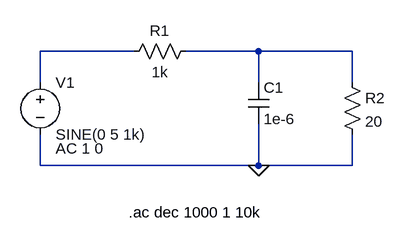
[diagram p0: schematic lowpass.asc]
lowpass.asc, the LTspice schematic file:
Version 4
SHEET 1 880 680
WIRE 384 224 240 224
WIRE 576 224 464 224
WIRE 720 224 576 224
WIRE 240 272 240 224
WIRE 576 272 576 224
WIRE 720 272 720 224
WIRE 240 400 240 352
WIRE 576 400 576 336
WIRE 576 400 240 400
WIRE 720 400 720 352
WIRE 720 400 576 400
FLAG 576 400 0
SYMBOL Res 480 208 R90
WINDOW 0 0 56 VBottom 2
WINDOW 3 32 56 VTop 2
SYMATTR InstName R1
SYMATTR Value 1k
SYMBOL Cap 560 272 R0
SYMATTR InstName C1
SYMATTR Value 1e-6
SYMBOL Res 704 256 R0
SYMATTR InstName R2
SYMATTR Value 20
SYMBOL voltage 240 256 R0
WINDOW 123 24 118 Left 2
SYMATTR InstName V1
SYMATTR Value SINE(0 5 1k)
SYMATTR Value2 AC 1 0
TEXT 376 472 Left 2 !.ac dec 1000 1 10k

The netlist it stands for:
* lowpass.asc
R1 N002 N001 1k
C1 N002 0 1e-6
R2 N002 0 20
V1 N001 0 SINE(0 5 1k) AC 1 0
.ac dec 1000 1 10k
.backanno
.end